# EAGLE schematic sous-vide_connect (EAGLE 6.6.0)
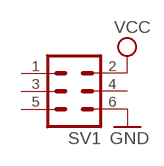
[diagram p0: schematic, sheet 1]

## Parts
SV1  ML6  [ML6]

## Nets
GND: SV1.6
VCC: SV1.2
Unconnected: SV1.1 SV1.3 SV1.4 SV1.5

## Library data of the parts
SV1 = con-ml:ML6: HARTING; OC_FARNELL: unknown; OC_NEWARK: unknown